# EAGLE design usb (EAGLE 6.5.0)
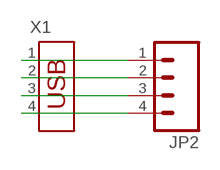
[diagram p0: schematic, sheet 1]

## Parts
JP2  M04PTH  [1X04]
X1  USB-787616  [USB]

## Nets
N$1: JP2.1 X1.1
N$2: JP2.2 X1.2
N$3: JP2.3 X1.3
N$4: JP2.4 X1.4

## Library data of the parts
JP2 = SparkFun-Connectors:M04: Header 4 Standard 4-pin 0.1" header. Use with straight break away headers (SKU : PRT-00116), right angle break away headers (PRT-00553), swiss pins (PRT-00743), machine pins (PRT-00117), and female headers (PRT-00115). Molex polarized connector foot print use with SKU : PRT-08231 with associated crimp pins and housings. 1MM SMD Version SKU: PRT-10208
X1 = con-amp:USB-787616: AMP connector

## Board
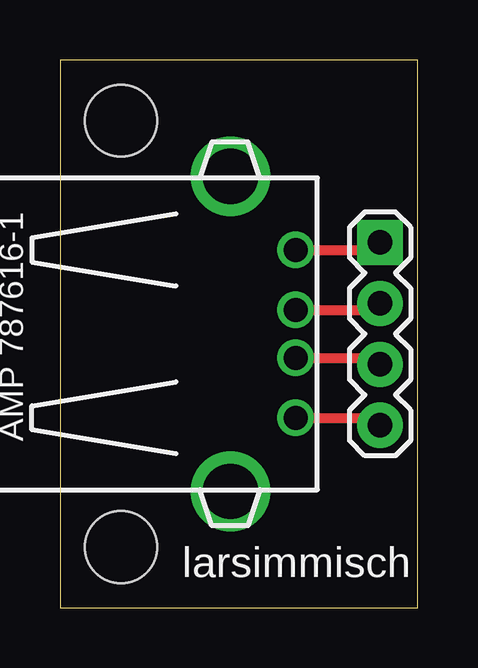
[diagram p1: board, top side]

Size 14.91 x 22.85 mm. Coordinates in mm from the lower left corner, seen from the top.
Outline: 0,0 14.91,0 14.91,22.85 0,22.85 0,0
Copper layers (1*16): Top 0.035mm / dielectric 1.5mm / Bottom 0.035mm
Design rules "default": minimum track width 10mil, minimum drill 24mil, track to track 8mil, track to pad 8mil, pad to pad 8mil, via to via 8mil, smd to smd 8mil, copper to edge 40mil, drill to drill 8mil, minimum pad ring 10mil, minimum via ring 8mil, stop-mask expansion 4mil, vias tented up to drill 0mil, thermal gap 10mil
Holes 3 mm at 2.54,20.32 2.54,2.54

### Footprints (pad centres in the part's own frame; a part is rotated, then mirrored left to right if it is on the bottom)
1X04 = drill 1.016 pad 1.88 square: 1 0,0 | drill 1.016 pad 1.88: 2 2.54,0; 3 5.08,0; 4 7.62,0
USB = drill 1: 1 -3.5,12.99; 2 -1,12.99; 3 1,12.99; 4 3.5,12.99 | drill 2.3: 5 -6.57,10.28; 6 6.57,10.28

### Placement (x,y rotation side)
JP2  13.34,15.24 270 top
X1  -3.17,11.43 270 top

### Tracks (layer width: path | path; a pad name or v marks a point on that pad's centre or on a via)
N$1
  Top 0.406: X1.1 13.03,14.93 JP2.1
N$2
  Top 0.406: X1.2 13.06,12.43 JP2.2
N$3
  Top 0.406: X1.3 13.06,10.43 JP2.3
N$4
  Top 0.406: X1.4 13.03,7.93 JP2.4

### Text on the board
tNames: larsimmisch
tValues: usb v1